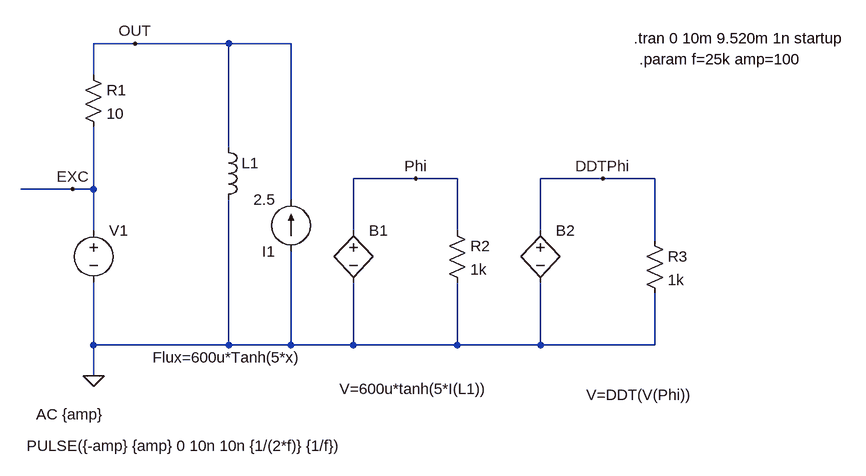
[diagram p0: schematic sby_nlinductor_with_external_field.asc]
sby_nlinductor_with_external_field.asc, the LTspice schematic file:
Version 4
SHEET 1 880 680
WIRE -672 -64 -736 -64
WIRE -528 -64 -672 -64
WIRE -432 -64 -528 -64
WIRE -736 -16 -736 -64
WIRE -528 96 -528 -64
WIRE -240 144 -336 144
WIRE -176 144 -240 144
WIRE 48 144 -48 144
WIRE 128 144 48 144
WIRE -768 160 -848 160
WIRE -736 160 -736 64
WIRE -736 160 -768 160
WIRE -432 176 -432 -64
WIRE -736 224 -736 160
WIRE -336 224 -336 144
WIRE -176 224 -176 144
WIRE -48 224 -48 144
WIRE 128 240 128 144
WIRE -736 400 -736 304
WIRE -528 400 -528 176
WIRE -528 400 -736 400
WIRE -432 400 -432 256
WIRE -432 400 -528 400
WIRE -336 400 -336 304
WIRE -336 400 -432 400
WIRE -176 400 -176 304
WIRE -176 400 -336 400
WIRE -48 400 -48 304
WIRE -48 400 -176 400
WIRE 128 400 128 320
WIRE 128 400 -48 400
WIRE -736 448 -736 400
FLAG -736 448 0
FLAG -672 -64 OUT
FLAG -240 144 Phi
FLAG 48 144 DDTPhi
FLAG -768 160 EXC
SYMBOL voltage -736 208 R0
WINDOW 3 -103 347 Left 2
WINDOW 123 -88 299 Left 2
WINDOW 39 0 0 Left 0
SYMATTR Value PULSE({-amp} {amp} 0 10n 10n {1/(2*f)} {1/f})
SYMATTR Value2 AC {amp}
SYMATTR InstName V1
SYMBOL bv -336 208 R0
WINDOW 3 -21 260 Left 2
SYMATTR Value V=600u*tanh(5*I(L1))
SYMATTR InstName B1
SYMBOL bv -48 208 R0
WINDOW 3 71 269 Left 2
SYMATTR Value V=DDT(V(Phi))
SYMATTR InstName B2
SYMBOL res -752 -32 R0
SYMATTR InstName R1
SYMATTR Value 10
SYMBOL res -192 208 R0
SYMATTR InstName R2
SYMATTR Value 1k
SYMBOL res 112 224 R0
SYMATTR InstName R3
SYMATTR Value 1k
SYMBOL ind -544 80 R0
WINDOW 3 -101 339 Left 2
SYMATTR Value Flux=600u*Tanh(5*x)
SYMATTR InstName L1
SYMBOL current -432 256 R180
WINDOW 123 0 0 Left 0
WINDOW 39 0 0 Left 0
SYMATTR InstName I1
SYMATTR Value 2.5
TEXT 96 -72 Left 2 !.tran 0 10m 9.520m 1n startup
TEXT 104 -40 Left 2 !.param f=25k amp=100

The netlist it stands for:
* sby_nlinductor_with_external_field.asc
V1 EXC 0 PULSE({-amp} {amp} 0 10n 10n {1/(2*f)} {1/f}) AC {amp}
B1 Phi 0 V=600u*tanh(5*I(L1))
B2 DDTPhi 0 V=DDT(V(Phi))
R1 OUT EXC 10
R2 Phi 0 1k
R3 DDTPhi 0 1k
L1 OUT 0 Flux=600u*Tanh(5*x)
I1 0 OUT 2.5
.tran 0 10m 9.520m 1n startup
.param f=25k amp=100
.backanno
.end